# Altium schematic sheet Connectors.SchDoc
size A4; SheetNumber: 2; SheetTotal: 11
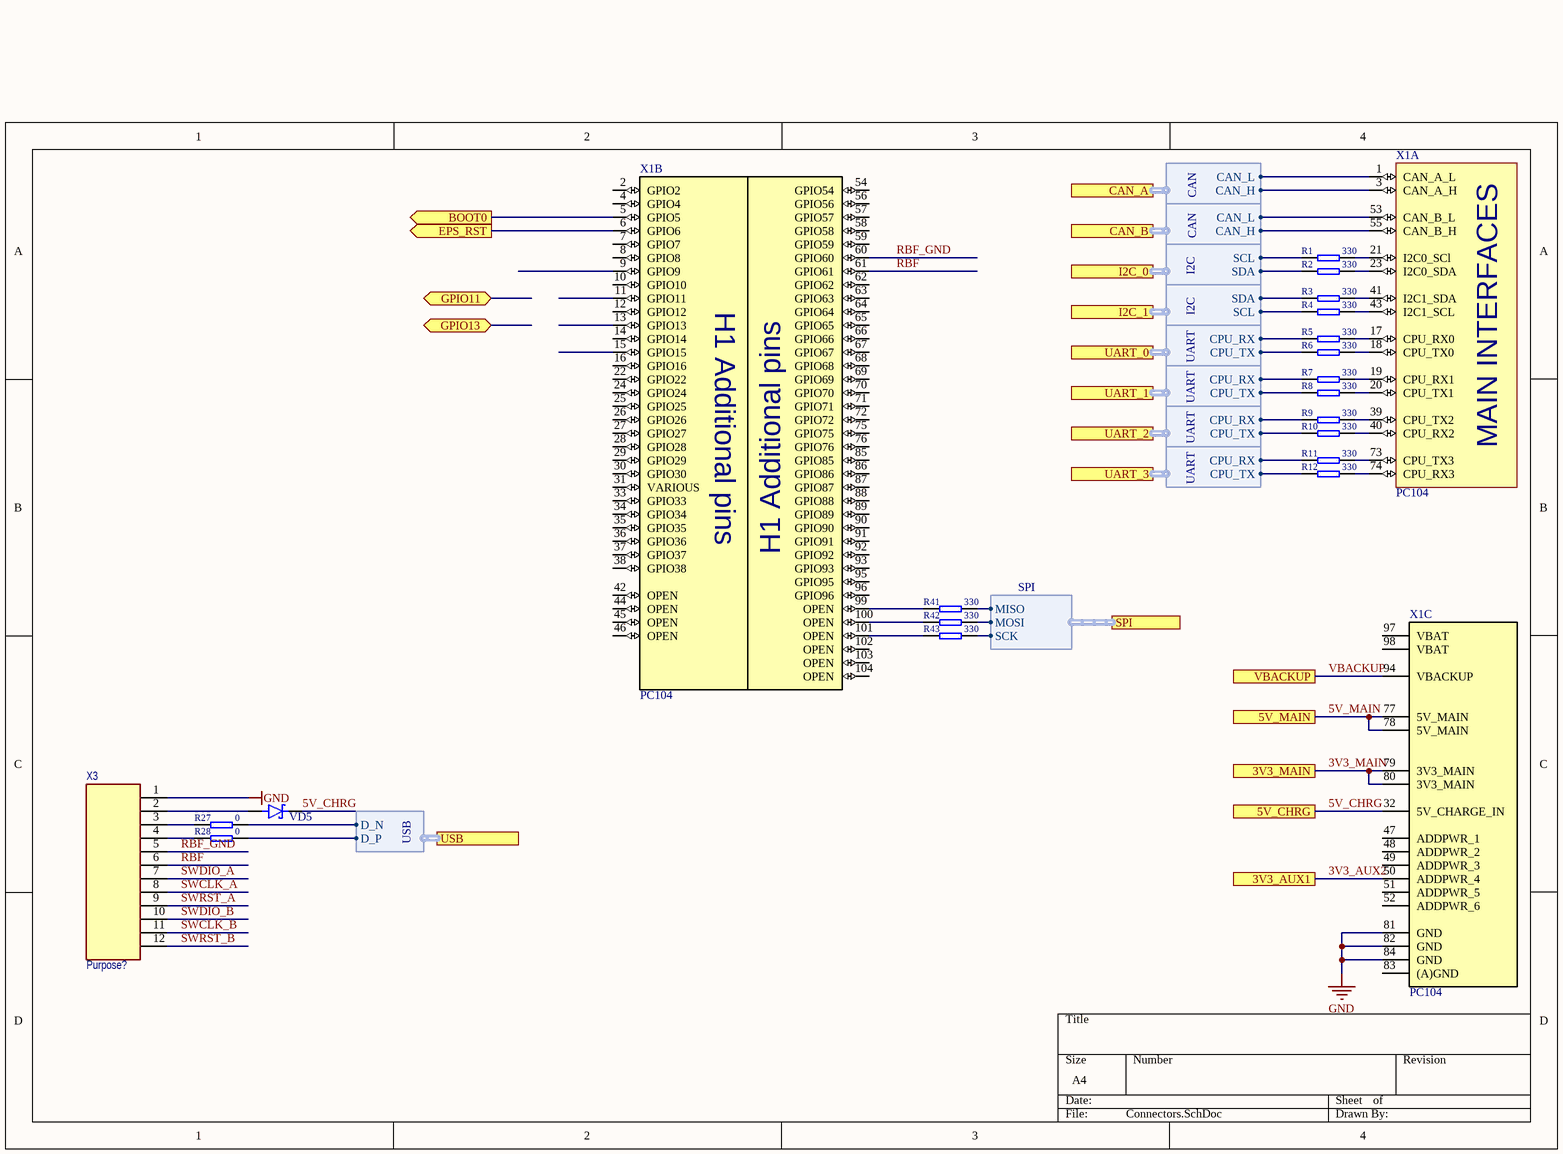
[diagram p0: Connectors.SchDoc]

## Parts
R1  value 330  [RES 0603]
R2  value 330  [RES 0603]
R3  value 330  [RES 0603]
R4  value 330  [RES 0603]
R5  value 330  [RES 0603]
R6  value 330  [RES 0603]
R7  value 330  [RES 0603]
R8  value 330  [RES 0603]
R9  value 330  [RES 0603]
R10  value 330  [RES 0603]
R11  value 330  [RES 0603]
R12  value 330  [RES 0603]
R27  value 0  [RES 0603]
R28  value 0  [RES 0603]
R41  value 330  [RES 0603]
R42  value 330  [RES 0603]
R43  value 330  [RES 0603]
VD5  (no value)  [SOD-123]
X1  PC104  [PC104_ArianSpace]  (parts A,B,C of 3)
X3  Purpose: Purpose?  [PicoBlade_12P]  (hidden comment: Header?)

## Ports
3V3_AUX1, 3V3_MAIN, 5V_CHRG, 5V_MAIN, BOOT0 (out), CAN_A (harness CAN), CAN_B (harness CAN), EPS_RST (out), GPIO11 (bidir), GPIO13 (bidir), I2C_0 (harness I2C), I2C_1 (harness I2C), SPI (harness SPI), UART_0 (harness UART), UART_1 (harness UART), UART_2 (harness UART), UART_3 (harness UART), USB (harness USB), VBACKUP

## Harnesses
CAN: CAN_H, CAN_L
I2C: SDA, SCL
UART: CPU_TX, CPU_RX
USB: D_N, D_P
SPI: SCK, MISO, MOSI

## Nets
GND: X1.81(GND) X1.82(GND) X1.84(GND) X3.1
3V3_AUX2: X1.50(ADDPWR_4) ; port 3V3_AUX1
3V3_MAIN: X1.79(3V3_MAIN) X1.80(3V3_MAIN) ; port 3V3_MAIN
5V_CHRG: VD5.C(Cathode) X1.32(5V_CHARGE_IN) ; port 5V_CHRG
5V_MAIN: X1.77(5V_MAIN) X1.78(5V_MAIN) ; port 5V_MAIN
BOOT0: X1.5(GPIO5) ; port BOOT0
EPS_RST: X1.6(GPIO6) ; port EPS_RST
RBF: X1.61(GPIO61) X3.6
RBF_GND: X1.60(GPIO60) X3.5
SWCLK_A: X3.8
SWCLK_B: X3.11
SWDIO_A: X3.7
SWDIO_B: X3.10
SWRST_A: X3.9
SWRST_B: X3.12
VBACKUP: X1.94(VBACKUP) ; port VBACKUP
NetR1_1: R1.1 ; port I2C_0.SCL
NetR1_2: R1.2 X1.21(I2C0_SCl)
NetR2_1: R2.1 ; port I2C_0.SDA
NetR2_2: R2.2 X1.23(I2C0_SDA)
NetR3_1: R3.1 ; port I2C_1.SDA
NetR3_2: R3.2 X1.41(I2C1_SDA)
NetR4_1: R4.1 ; port I2C_1.SCL
NetR4_2: R4.2 X1.43(I2C1_SCL)
NetR5_1: R5.1 ; port UART_0.CPU_RX
NetR5_2: R5.2 X1.17(CPU_RX0)
NetR6_1: R6.1 ; port UART_0.CPU_TX
NetR6_2: R6.2 X1.18(CPU_TX0)
NetR7_1: R7.1 ; port UART_1.CPU_RX
NetR7_2: R7.2 X1.19(CPU_RX1)
NetR8_1: R8.1 ; port UART_1.CPU_TX
NetR8_2: R8.2 X1.20(CPU_TX1)
NetR9_1: R9.1 ; port UART_2.CPU_RX
NetR9_2: R9.2 X1.39(CPU_TX2)
NetR10_1: R10.1 ; port UART_2.CPU_TX
NetR10_2: R10.2 X1.40(CPU_RX2)
NetR11_1: R11.1 ; port UART_3.CPU_RX
NetR11_2: R11.2 X1.73(CPU_TX3)
NetR12_1: R12.1 ; port UART_3.CPU_TX
NetR12_2: R12.2 X1.74(CPU_RX3)
NetR27_1: R27.1 X3.3
NetR27_2: R27.2 ; port USB.D_N
NetR28_1: R28.1 X3.4
NetR28_2: R28.2 ; port USB.D_P
NetR41_1: R41.1 X1.99(OPEN)
NetR41_2: R41.2 ; port SPI.MISO
NetR42_1: R42.1 X1.100(OPEN)
NetR42_2: R42.2 ; port SPI.MOSI
NetR43_1: R43.1 X1.101(OPEN)
NetR43_2: R43.2 ; port SPI.SCK
NetVD5_A: VD5.A(Anode) X3.2
NetX1_1: X1.1(CAN_A_L) ; port CAN_A.CAN_L
NetX1_3: X1.3(CAN_A_H) ; port CAN_A.CAN_H
NetX1_53: X1.53(CAN_B_L) ; port CAN_B.CAN_L
NetX1_55: X1.55(CAN_B_H) ; port CAN_B.CAN_H

Not connected (* = marked no-connect by the designer): X1 2(GPIO2) 4(GPIO4) 7(GPIO7) 8(GPIO8) 9(GPIO9) 10(GPIO10) 11(GPIO11) 12(GPIO12) 13(GPIO13) 14(GPIO14) 15(GPIO15) 16(GPIO16) 22(GPIO22) 24(GPIO24) 25(GPIO25) 26(GPIO26) 27(GPIO27) 28(GPIO28) 29(GPIO29) 30(GPIO30) 31(VARIOUS) 33(GPIO33) 34(GPIO34) 35(GPIO35) 36(GPIO36) 37(GPIO37) 38(GPIO38) 42(OPEN) 44(OPEN) 45(OPEN) 46(OPEN) 47(ADDPWR_1) 48(ADDPWR_2) 49(ADDPWR_3) 51(ADDPWR_5) 52(ADDPWR_6) 54(GPIO54) 56(GPIO56) 57(GPIO57) 58(GPIO58) 59(GPIO59) 62(GPIO62) 63(GPIO63) 64(GPIO64) 65(GPIO65) 66(GPIO66) 67(GPIO67) 68(GPIO68) 69(GPIO69) 70(GPIO70) 71(GPIO71) 72(GPIO72) 75(GPIO75) 76(GPIO76) 83((A)GND) 85(GPIO85) 86(GPIO86) 87(GPIO87) 88(GPIO88) 89(GPIO89) 90(GPIO90) 91(GPIO91) 92(GPIO92) 93(GPIO93) 95(GPIO95) 96(GPIO96) 97(VBAT) 98(VBAT) 102(OPEN) 103(OPEN) 104(OPEN)

## Notes on the sheet
- (in symbol PC104_ArianSpace, part A) MAIN INTERFACES
- (in symbol PC104_ArianSpace, part B) H1 Additional pins

## Library data of the parts
R1-R12 R27 R28 R41-R43 = !Resistor: Resistor; IsSMT: NoSMT
VD5 = DiodeS: Diode Shottky; IsSMT: NoSMT
X1 = PC104_ArianSpace: PC104 connector
X3 = Header 1x12: 10x1 Header; IsSMT: NoSMT